# EasyEDA Pro project 平衡车.epro

# Schematic Schematic2_1
Create Date: 2023-04-02; Page Name: P1_1; Project Name: 平衡小车（大鱼电子）; Schematic Name: Schematic2_1; Update Date: 2024-01-26; Add into BOM: yes; Company: 深圳嘉立创科技发展有限公司; Convert to PCB: yes; Drawed: 嘉立创EDA; Page Size: A3; Part Number: JLCPCB-001; Reviewed: 嘉立创EDA; Version: V0.1
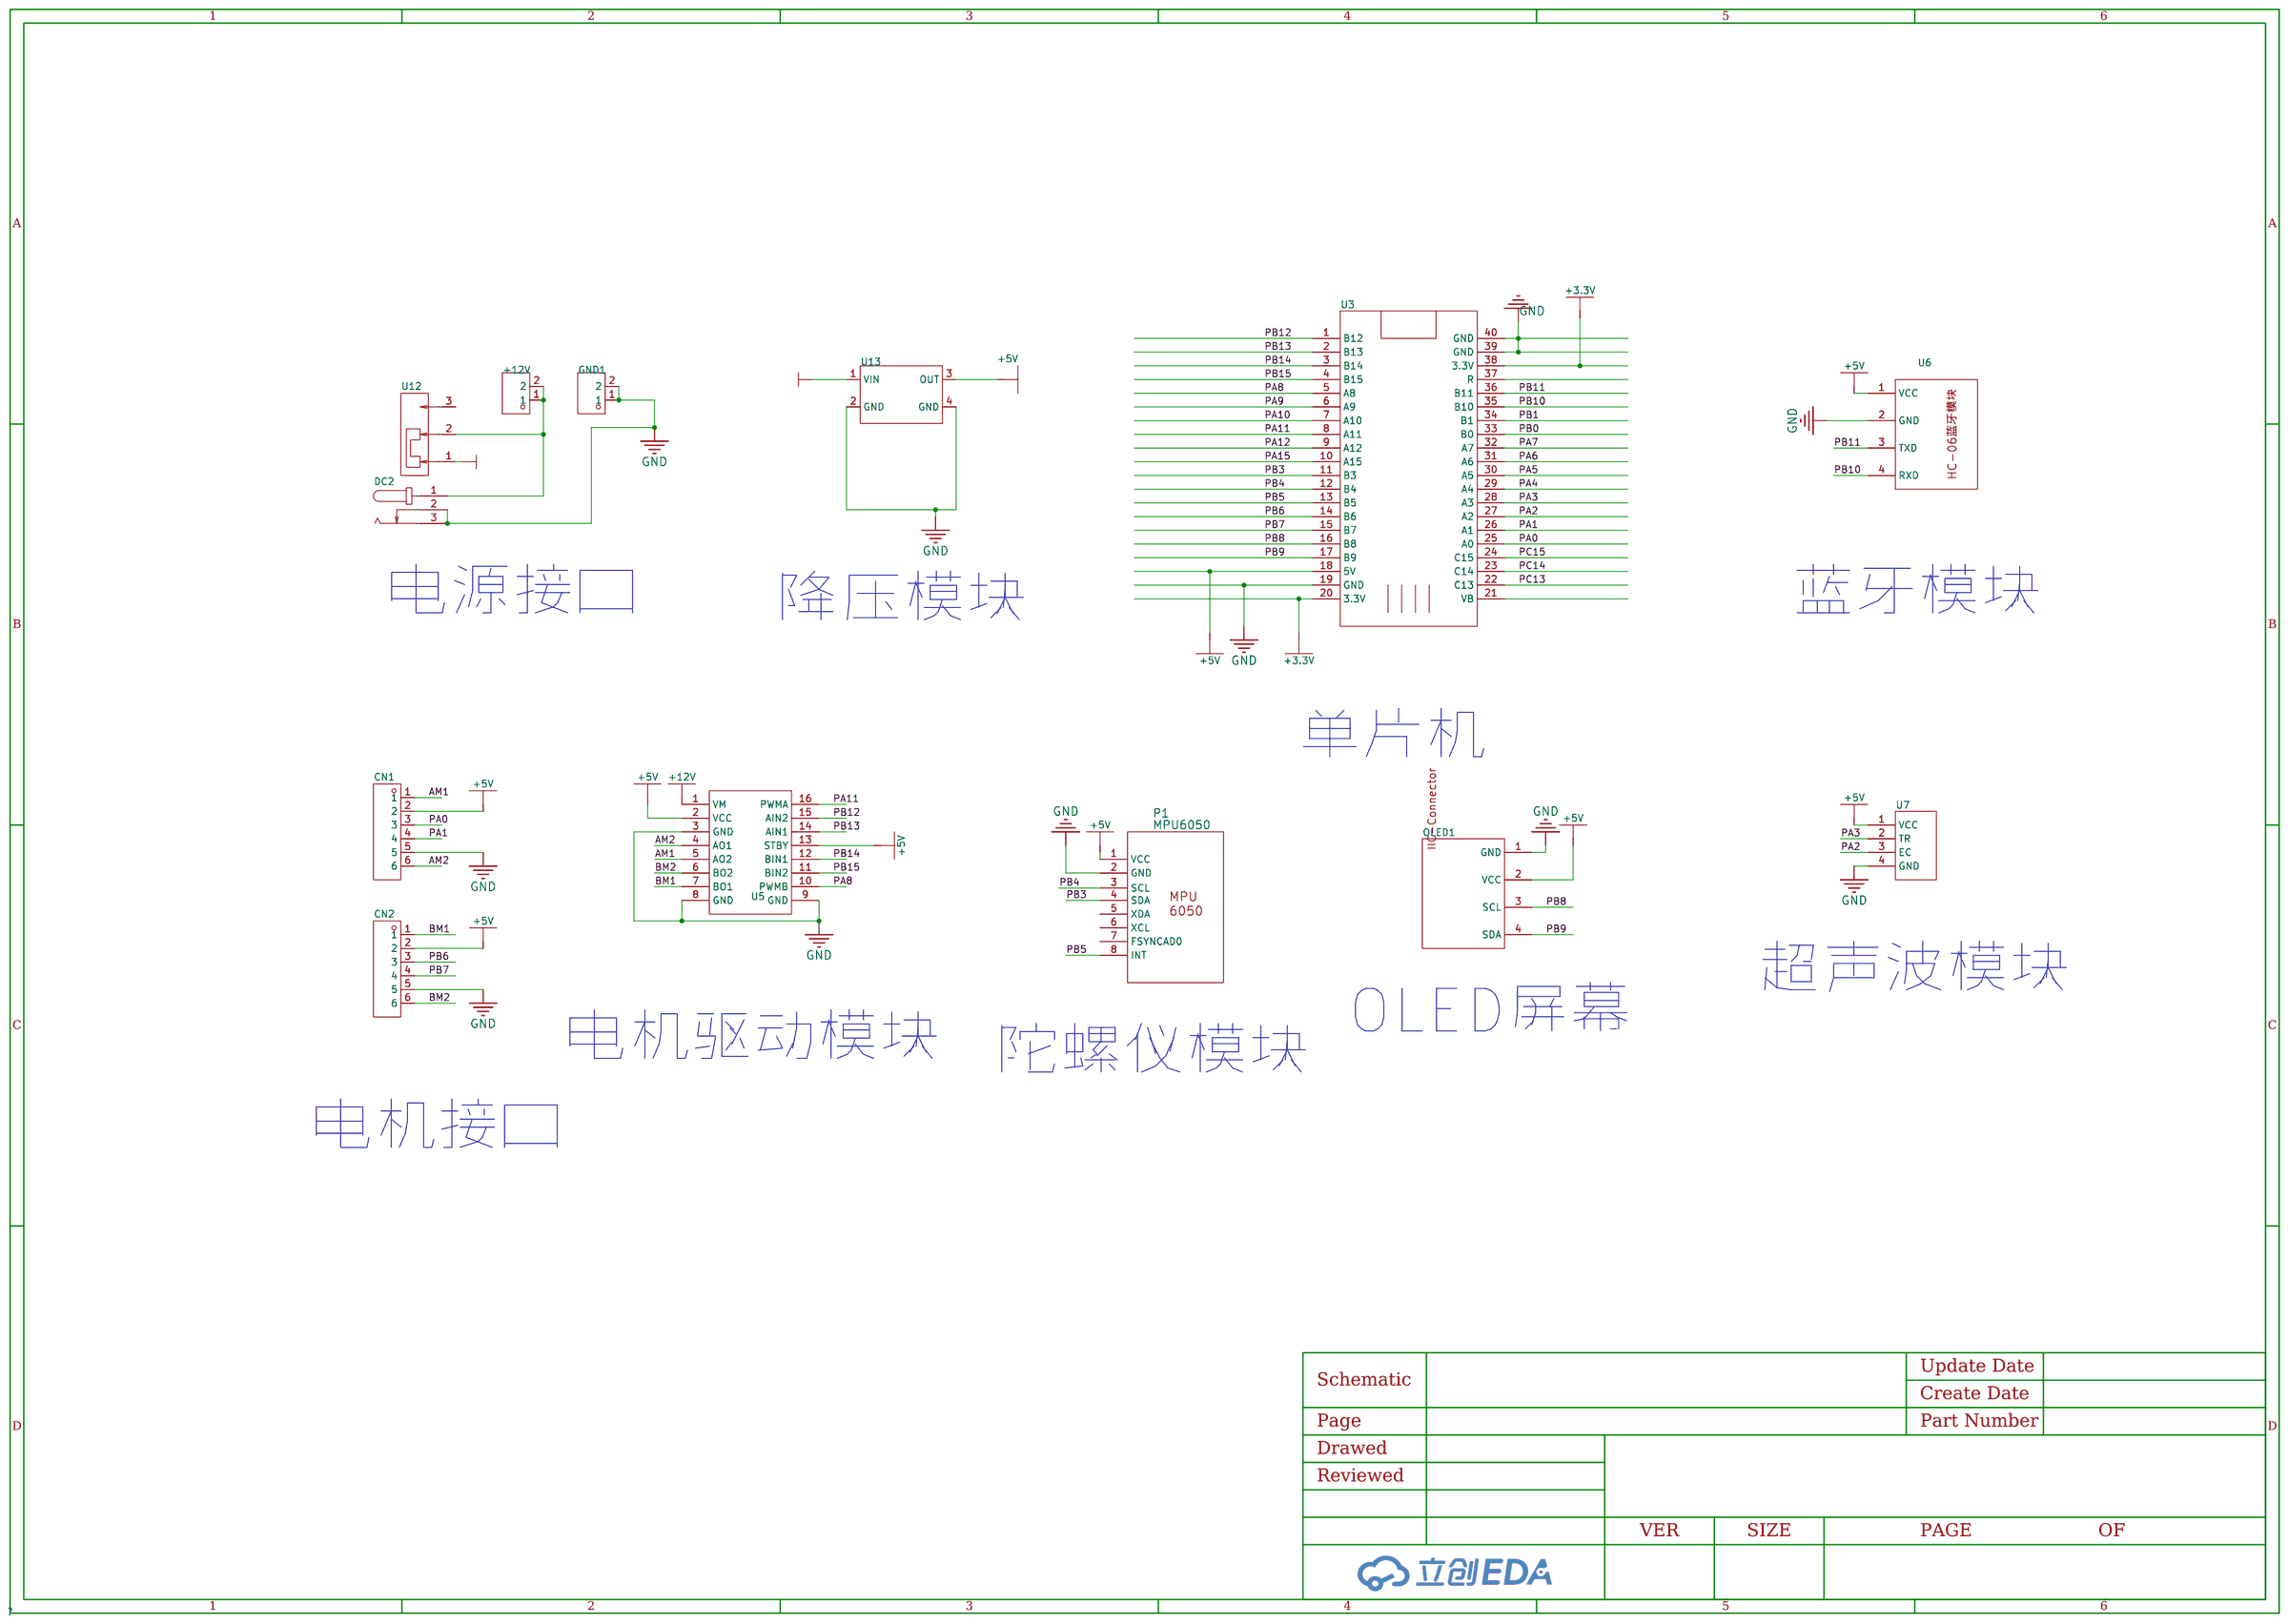
[diagram p0: schematic sheet]

## Parts
+12V  -  [HDR-TH_2P-P2.54-V]
CN1  PH2.0-6P  [PH2.0-6P 直针端子座]
CN2  PH2.0-6P  [PH2.0-6P 直针端子座]
DC2  -  [DC-IN-TH_KH-DC-005-2.5]
GND1  -  [HDR-TH_2P-P2.54-V]
OLED1  -  [0.96OLED_4P]
P1  MPU6050  [MPU6050]
U3  -  [STM32F103C8T6核心板]
U5  -  [TB6612FNG Module - 8pin x 2]
U6  蓝牙模块HC-06  [DIP-1X4P2.54（HC-06蓝牙模块）]
U7  -  [排母-4P]
U12  SS-12D10-G5  [SW-TH_SS-12D10-G050]
U13  -  [MP1584模块]

## Library data of the parts
+12V GND1 = 排针2P: 2.54 1*2P 直排针 0.8u镀金 PBT RoHS,针长3*6mm; Supplier Part: C152154; Manufacturer: Nextron(台湾正凌); Manufacturer Part: Z-211-0211-0021-001; LCSC On Sale: 1; Supplier Footprint: Through Hole,P=2.54mm; JLCPCB Part Class: Extended Part; JLCPCB Stock Number: 5280; Datasheet: https://atta.szlcsc.com/upload/public/pdf/source/20171225/C152154_15141883746031203216.pdf; Supplier: LCSC; Number of Positions: 2; Connector Type: 排针; Number of Rows: 1; Mounting Type: 通孔; Contact Type: 公形引脚; Pitch: 0.100; Contact Material: 黄铜
CN1 CN2 = PH2.0-6P: Pin Type: IN; Supplier: LCSC; Supplier Part: C722763; Manufacturer: CAX(创都); Manufacturer Part: PH2.0-4P; JLCPCB Part Class: Extended Part
DC2 = KH-DC-005-2.5: 连接器类型:DC电源插座;安装方式:弯插;触点内径:-;触点外径:6.4mm;额定电流:1A;额定电压:30V;工作温度范围:-25~+70;; LCSC Part Name: DC电源插座 外径:6.4mm; Supplier Part: C2847170; Manufacturer: kinghelm(金航标); Supplier Footprint: 插件; JLCPCB Part Class: Extended Part; Datasheet: https://atta.szlcsc.com/upload/public/pdf/source/20210716/C2847170_7F0110A0BEDEE81C68B76DF87AC8DA16.pdf; Supplier: LCSC; Connector Type: DC电源插座; Mounting Style: 弯插; Outside Contact Diameter: 6.4mm; Current Rating (Max): 1A; Voltage Rating (Max): 30V; Operating Temperature Range: -25~+70
OLED1 = 0.96OLED_4P: LCSC Part Name: 0.96OLED_4P_MODULE_JX; Supplier Part: C9900004566; Manufacturer Part: 0.96OLED_4P_MODULE_JX; Supplier Footprint: THrough hole; JLCPCB Part Class: Extended Part; Supplier: LCSC
P1 = MPU6050
U3 = stm32f103c8t6最小系统板
U5 = TB6612FNG模块: Pin Type: In
U6 = 蓝牙模块HC-06: Pin Type: IN
U7 = HC-SR04_1
U12 = SS-12D10-G5: 电路结构:单刀双掷;安装方式:直插;开关颜色:黑色;滑钮形状:矩形柱状;引脚样式:PC引脚;开关长度:12.7mm;开关宽度:6.7mm;开关高度:11.3mm;; LCSC Part Name: 插件大电流拨动开关; Supplier Part: C2998777; Manufacturer: DEALON(德艺隆); Supplier Footprint: 插件; JLCPCB Part Class: Extended Part; Datasheet: https://atta.szlcsc.com/upload/public/pdf/source/20220428/E10CB334ACBAF32CF4AF8D87DA871CD3.pdf; Supplier: LCSC; Circuit: 单刀双掷; Mounting Style: 直插; Actuator Color: 黑色; Actuator Style: 矩形柱状; Pin Style: PC引脚; Switch Length: 12.7mm; Switch Width: 6.7mm; Switch Height: 11.3mm
U13 = MP1584模块: Pin Type: IN

## Nets
+3.3V: U3.20(3.3V) U3.38(3.3V)
+5V: CN1.2 CN2.2 OLED1.2(VCC) P1.1(VCC) U3.18(5V) U5.2(VCC) U5.13(STBY) U6.1(VCC) U7.1(VCC) U13.3(OUT)
+12V: U5.1(VM) U12.1 U13.1(VIN)
GND: CN1.5 CN2.5 DC2.2 DC2.3 GND1.1 GND1.2 OLED1.1(GND) P1.2(GND) U3.19(GND) U3.39(GND) U3.40(GND) U5.3(GND) U5.8(GND) U5.9(GND) U6.2(GND) U7.4(GND) U13.2(GND) U13.4(GND)
AM1: CN1.1 U5.5(AO2)
AM2: CN1.6 U5.4(AO1)
BM1: CN2.1 U5.7(BO1)
BM2: CN2.6 U5.6(BO2)
PA0: CN1.3 U3.25(A0)
PA1: CN1.4 U3.26(A1)
PA2: U3.27(A2) U7.3(EC)
PA3: U3.28(A3) U7.2(TR)
PA4: U3.29(A4)
PA5: U3.30(A5)
PA6: U3.31(A6)
PA7: U3.32(A7)
PA8: U3.5(A8) U5.10(PWMB)
PA9: U3.6(A9)
PA10: U3.7(A10)
PA11: U3.8(A11) U5.16(PWMA)
PA12: U3.9(A12)
PA15: U3.10(A15)
PB0: U3.33(B0)
PB1: U3.34(B1)
PB3: P1.4(SDA) U3.11(B3)
PB4: P1.3(SCL) U3.12(B4)
PB5: P1.8(INT) U3.13(B5)
PB6: CN2.3 U3.14(B6)
PB7: CN2.4 U3.15(B7)
PB8: OLED1.3(SCL) U3.16(B8)
PB9: OLED1.4(SDA) U3.17(B9)
PB10: U3.35(B10) U6.4(RXD)
PB11: U3.36(B11) U6.3(TXD)
PB12: U3.1(B12) U5.15(AIN2)
PB13: U3.2(B13) U5.14(AIN1)
PB14: U3.3(B14) U5.12(BIN1)
PB15: U3.4(B15) U5.11(BIN2)
PC13: U3.22(C13)
PC14: U3.23(C14)
PC15: U3.24(C15)
$3N3363: +12V.1 +12V.2 DC2.1 U12.2

Not connected (* = marked no-connect by the designer): P1 5(XDA) 6(XCL) 7(FSYNCAD0); U3 21(VB) 37(R); U12 3

## Notes on the sheet
- 电源接口
- 降压模块
- 蓝牙模块
- 单片机
- 超声波模块
- OLED屏幕
- 电机驱动模块
- 陀螺仪模块
- 电机接口

# Board 标准版
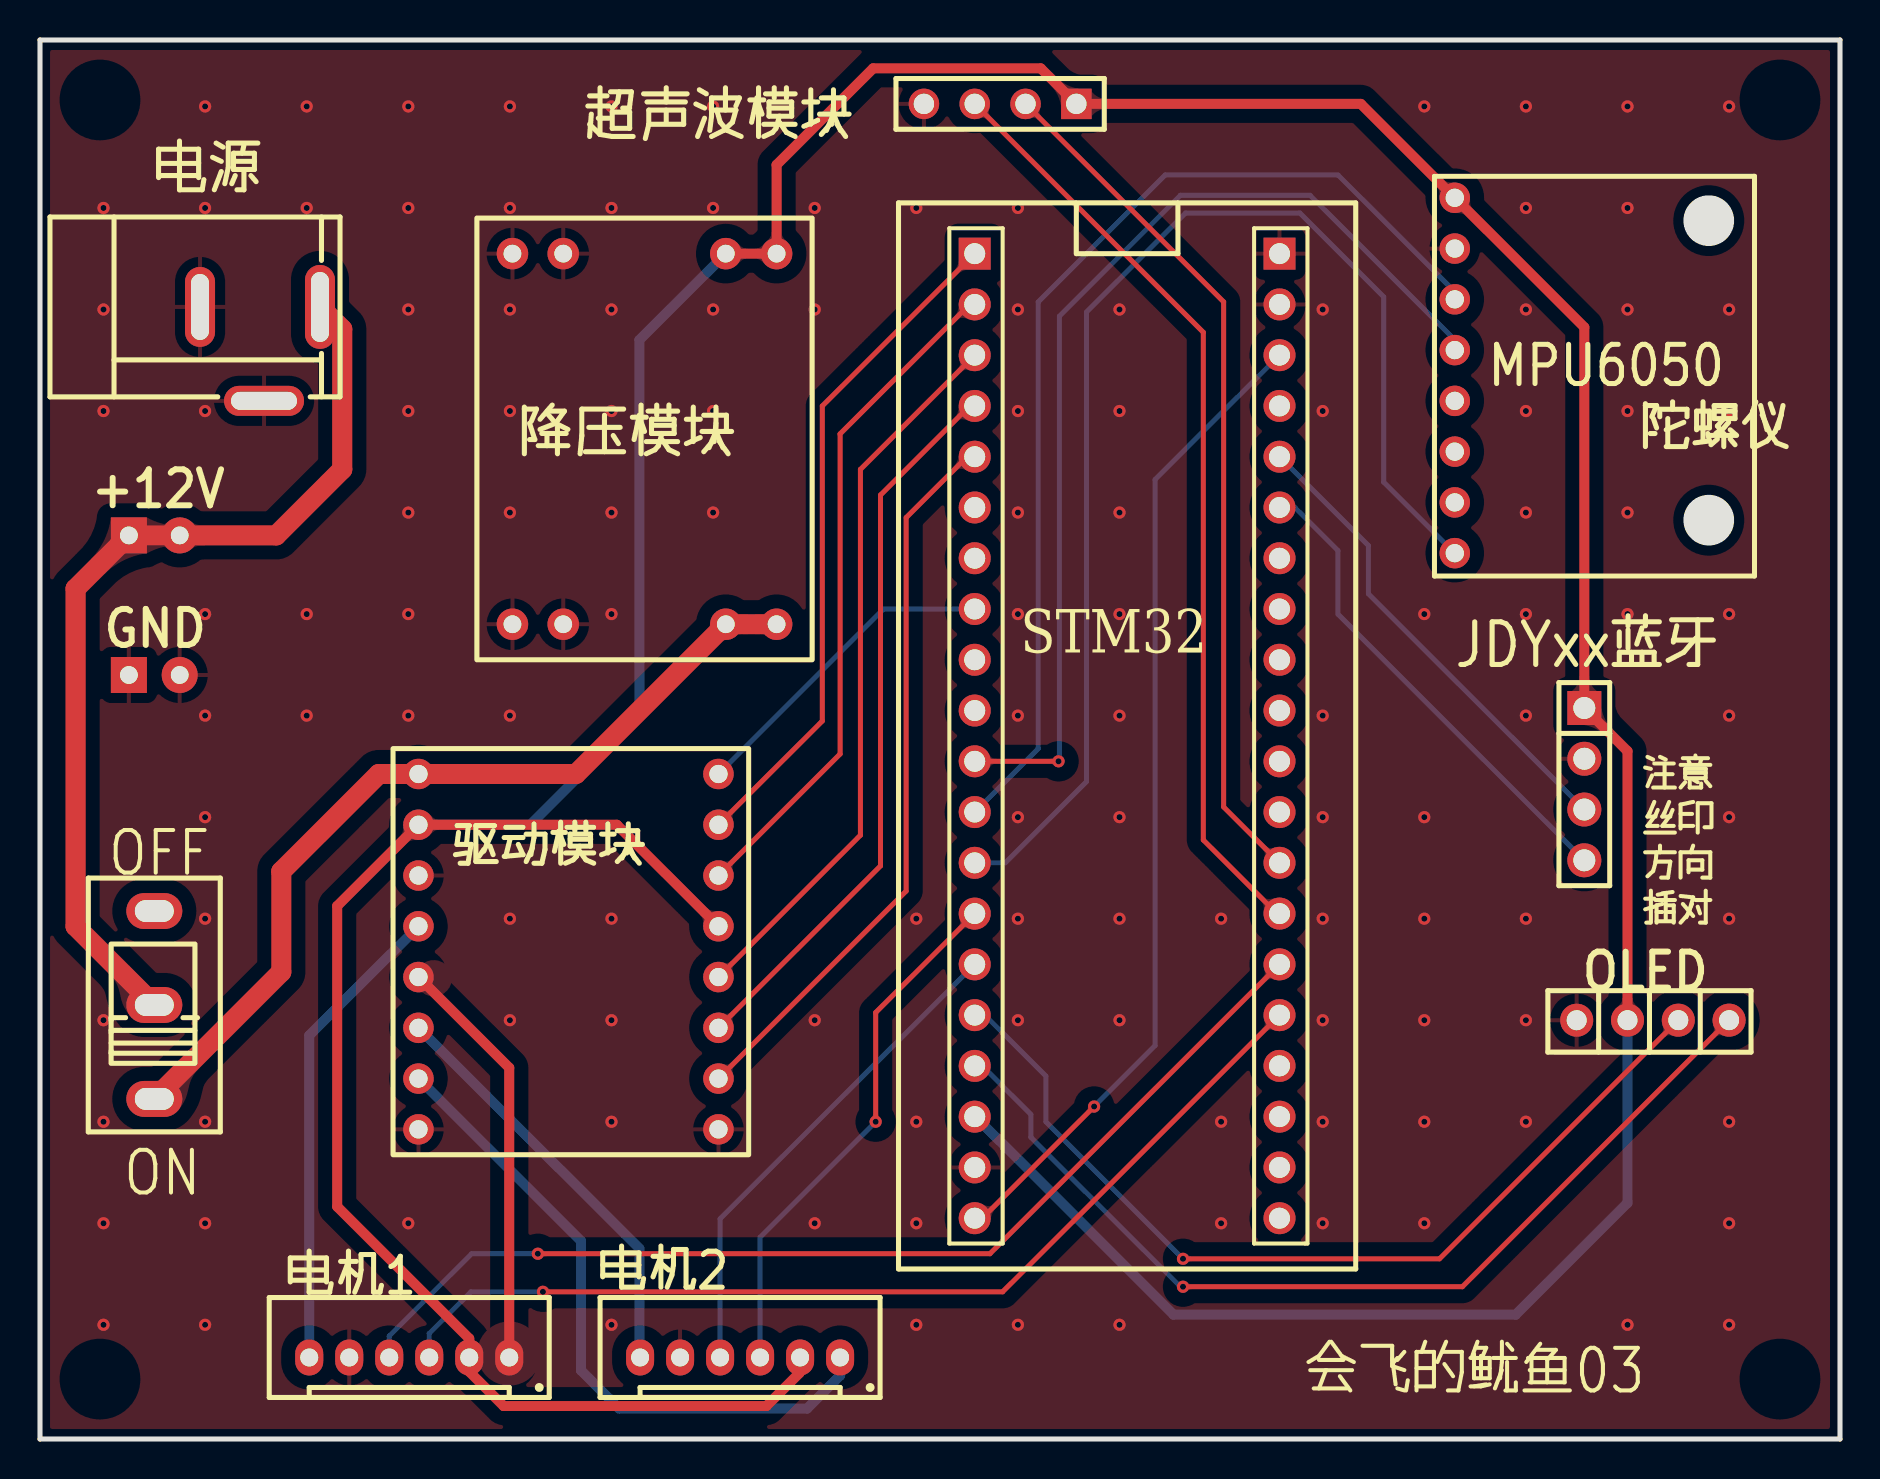
[diagram p1: board, top side]
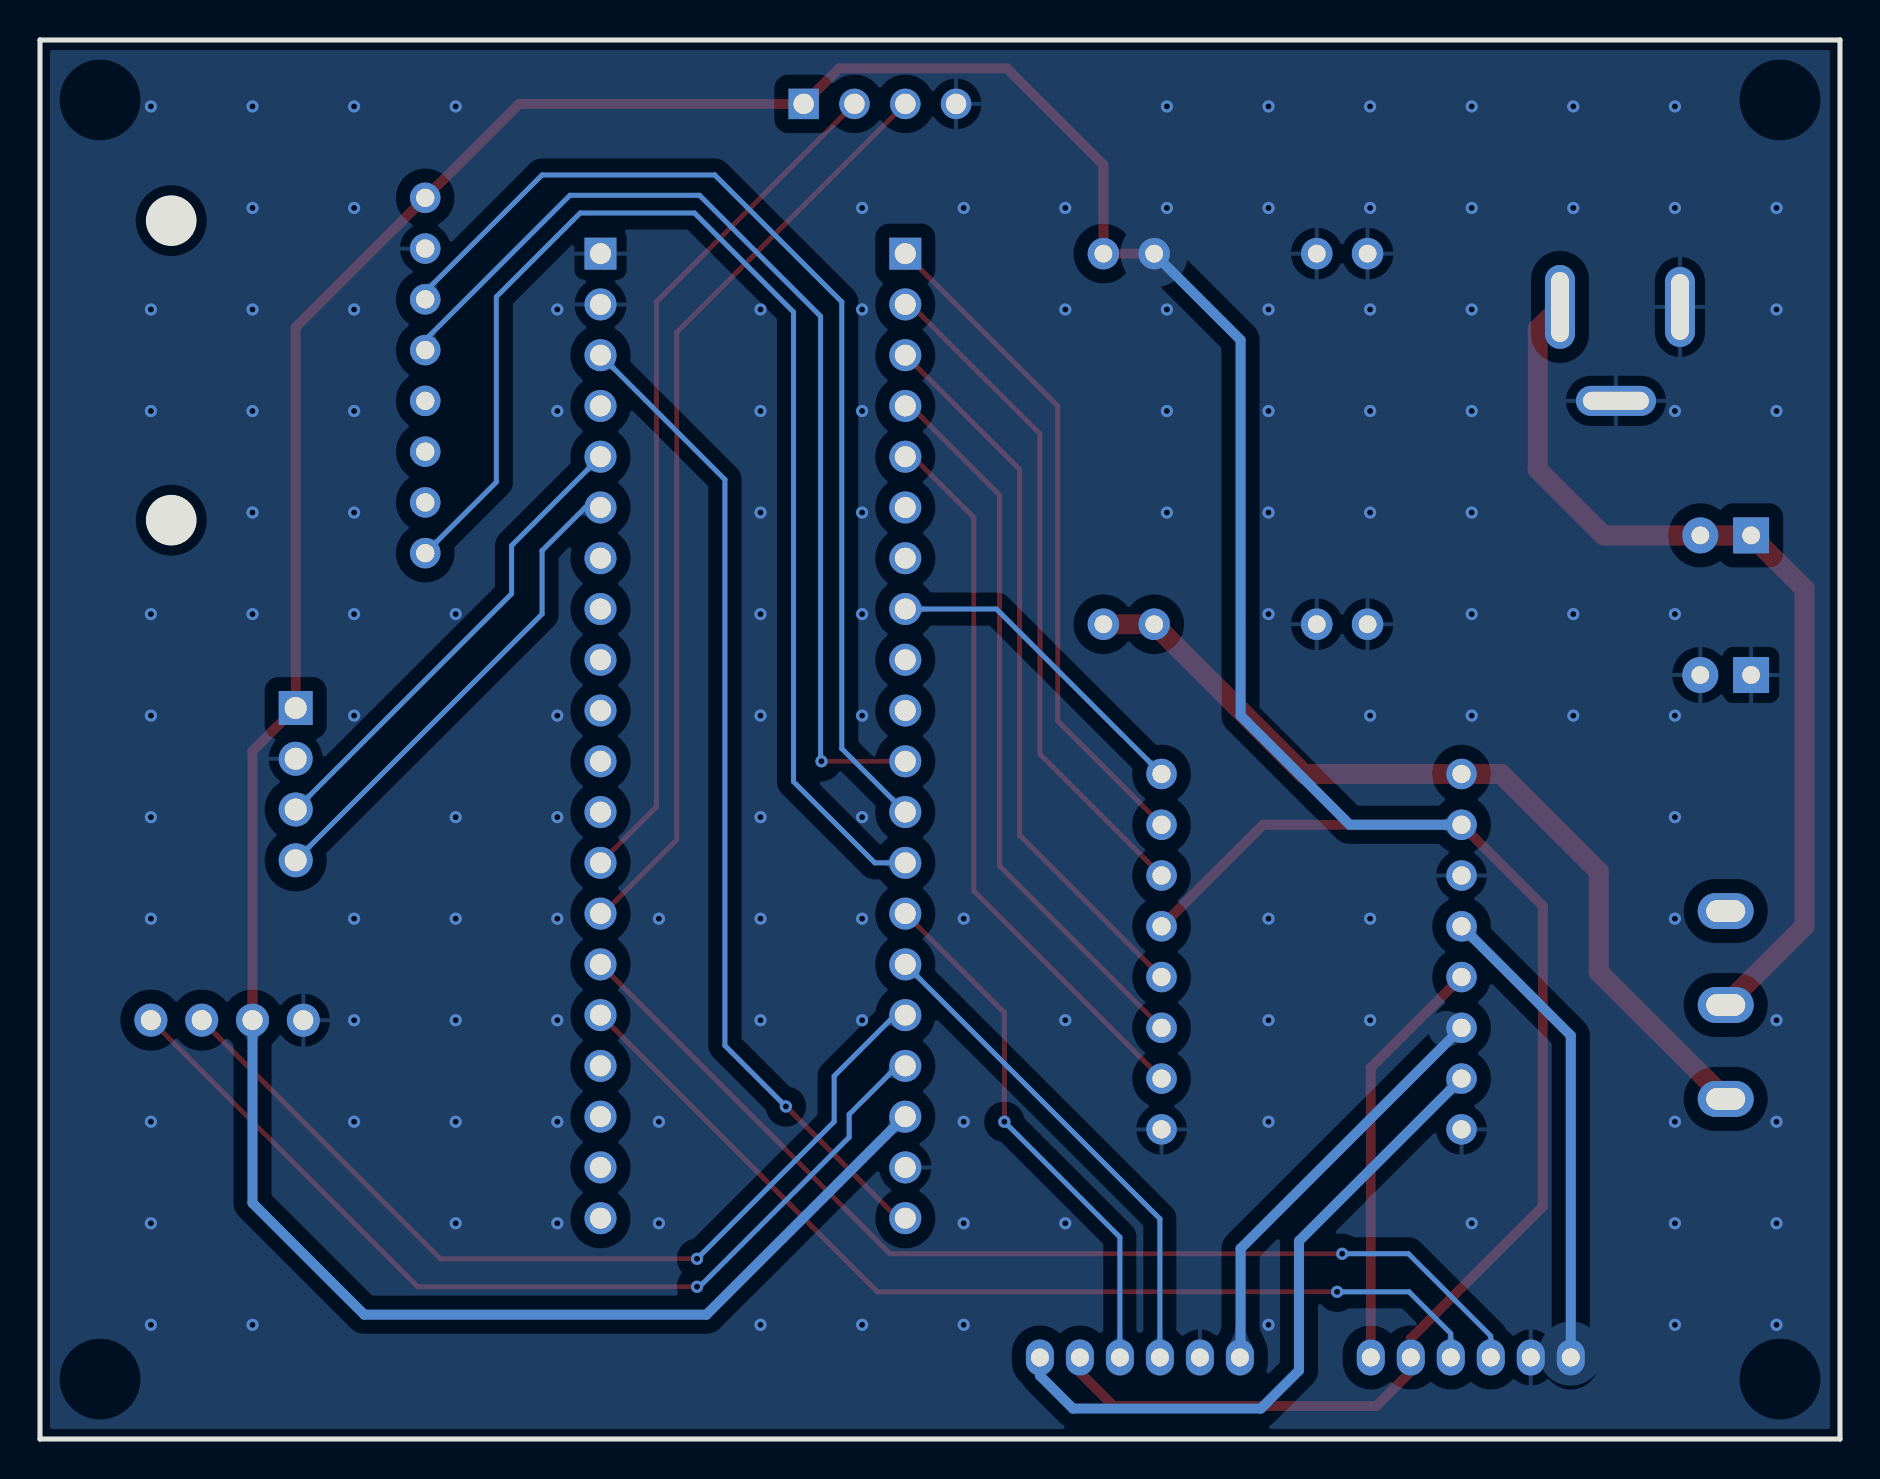
[diagram p2: board, bottom side, seen from below]

Outline 90 x 70 mm; copper layers: Top Layer, Bottom Layer. Coordinates in mm from the lower left corner of the outline.
Outline path: 0,70 90,70 90,0 0,0 0,70
Stack: Top Layer 0.035mm / Dielectric1 1.51mm FR4 er 4.5 / Bottom Layer 0.035mm

## Design rules (mm)
spacing safeClearance (default): track to track 0.152, other pairs 0.152 to 0.3
track width trackWidth (default): min 0.127, default 0.254, max 2.54
differential pair differentialPair (default): width min 0.127, default 0.254, max 2.54; gap min 0.152, default 0.152
via viaSize (default): diameter min 0.5, default 0.61, max 10; hole min 0.3, default 0.305, max 6
template: 用户自定义配置
spacing safeClearance (default): track to track 0.5, other pairs 0.5 to 0.5
track width trackWidth (default): min 0.127, default 0.254, max 2.54
differential pair differentialPair (default): width min 0.127, default 0.254, max 2.54; gap min 0.152, default 0.152
via viaSize (default): diameter min 0.5, default 0.61, max 10; hole min 0.3, default 0.305, max 6

## Placement (name value [footprint] x y rotation side)
+12V  -  [HDR-TH_2P-P2.54-V]  5.72 45.21 0 top
DC2  -  [DC-IN-TH_KH-DC-005-2.5]  11 54.29 0 top
GND  -  [HDR-TH_2P-P2.54-V]  5.72 38.23 0 top
OLED  -  [0.96OLED_4P]  80.64 20.95 0 top
P1  -  [MPU6050]  69.72 43.18 0 top
U3  -  [STM32F103C8T6核心板]  54.36 35.18 0 top
U6  蓝牙模块HC-06  [DIP-1X4P2.54（HC-06蓝牙模块）]  77.22 32.77 180 top
U7  -  [排母-4P]  51.82 66.8 180 top
U12  SS-12D10-G5  [SW-TH_SS-12D10-G050]  5.72 21.72 90 top
U13  -  [MP1584模块]  30.23 50.04 90 top
电机1  PH2.0-6P  [PH2.0-6P 直针端子座]  23.46 4.08 180 top
电机2  PH2.0-6P  [PH2.0-6P 直针端子座]  40.01 4.08 180 top
驱动模块  -  [TB6612FNG Module - 8pin x 2]  26.54 24.38 0 top

## Footprints (pads in the part's own frame, mm; a bottom-side part is the same pattern mirrored in y, then rotated)
0.96OLED_4P
  round 1.651 hole 1.001: 1(-3.81,0) 2(-1.27,0.003) 3(1.27,0.003) 4(3.81,0.003)
DC-IN-TH_KH-DC-005-2.5
  oval 1.501x4.201 hole 0.899x3.5: 1(2.999,2.349)
  oval 1.501x4 hole 0.899x3.3: 2(-2.999,2.349)
  oval 4x1.501 hole 3.3x0.899: 3(0.201,-2.349)
DIP-1X4P2.54（HC-06蓝牙模块）
  rect 1.7x1.7 hole 1.1: 1(0,-3.81)
  round 1.7 hole 1.1: 2(0,-1.27) 3(0,1.27) 4(0,3.81)
HDR-TH_2P-P2.54-V
  rect 1.801x1.801 hole 0.889: 1(-1.27,0)
  round 1.801 hole 0.889: 2(1.27,0)
MP1584模块
  round 1.575 hole 0.889: 1(-9.271,-4.064) 1(-9.271,-6.604) 2(-9.271,6.604) 2(-9.271,4.064) 3(9.271,-4.064) 3(9.271,-6.604) 4(9.271,6.604) 4(9.271,4.064)
MPU6050
  round 1.524 hole 0.914: 1(1.016,18.923) 2(1.016,16.383) 3(1.016,13.843) 4(1.016,11.303) 5(1.016,8.763) 6(1.016,6.223) 7(1.016,3.683) 8(1.016,1.143)
PH2.0-6P 直针端子座
  oval 1.4x1.8 hole 0.9: 1(0,0) 2(2,0) 3(4,0) 4(6,0) 5(8,0) 6(10,0)
STM32F103C8T6核心板
  rect 1.6x1.6 hole 1.049: 1(-7.62,24.13) 40(7.62,24.13)
  round 1.6 hole 1.049: 2(-7.62,21.59) 3(-7.62,19.05) 4(-7.62,16.51) 5(-7.62,13.97) 6(-7.62,11.43) 7(-7.62,8.89) 8(-7.62,6.35) 9(-7.62,3.81) 10(-7.62,1.27) 11(-7.62,-1.27) 12(-7.62,-3.81) 13(-7.62,-6.35) 14(-7.62,-8.89) 15(-7.62,-11.43) 16(-7.62,-13.97) 17(-7.62,-16.51) 18(-7.62,-19.05) 19(-7.62,-21.59) 20(-7.62,-24.13) 21(7.62,-24.13) 22(7.62,-21.59) 23(7.62,-19.05) 24(7.62,-16.51) 25(7.62,-13.97) 26(7.62,-11.43) 27(7.62,-8.89) 28(7.62,-6.35) 29(7.62,-3.81) 30(7.62,-1.27) 31(7.62,1.27) 32(7.62,3.81) 33(7.62,6.35) 34(7.62,8.89) 35(7.62,11.43) 36(7.62,13.97) 37(7.62,16.51) 38(7.62,19.05) 39(7.62,21.59)
SW-TH_SS-12D10-G050
  oval 1.8x2.8 hole 1.1x1.95: 1(-4.7,0) 2(0,0) 3(4.7,0)
TB6612FNG Module - 8pin x 2
  round 1.524 hole 0.914: 1(-7.62,8.89) 2(-7.62,6.35) 3(-7.62,3.81) 4(-7.62,1.27) 5(-7.62,-1.27) 6(-7.62,-3.81) 7(-7.62,-6.35) 8(-7.62,-8.89) 9(7.38,-8.89) 10(7.38,-6.35) 11(7.38,-3.81) 12(7.38,-1.27) 13(7.38,1.27) 14(7.38,3.81) 15(7.38,6.35) 16(7.38,8.89)
排母-4P
  rect 1.524x1.524 hole 1.02: 1(0,0)
  round 1.524 hole 1.02: 2(2.54,0) 3(5.08,0) 4(7.62,0)

## Nets
+3.3V: U3.20 U3.38
+5V: OLED.2 P1.1 U3.18 U6.1 U7.1 U13.3 电机1.2 电机2.2 驱动模块.2 驱动模块.13
+12V: U12.1 U13.1 驱动模块.1
GND: DC2.2 DC2.3 GND.1 GND.2 OLED.1 P1.2 U3.19 U3.39 U3.40 U6.2 U7.4 U13.2 U13.4 电机1.5 电机2.5 驱动模块.3 驱动模块.8 驱动模块.9
AM1: 电机1.1 驱动模块.5
AM2: 电机1.6 驱动模块.4
BM1: 电机2.1 驱动模块.7
BM2: 电机2.6 驱动模块.6
PA0: U3.25 电机1.3
PA1: U3.26 电机1.4
PA2: U3.27 U7.3
PA3: U3.28 U7.2
PA4: U3.29
PA5: U3.30
PA6: U3.31
PA7: U3.32
PA8: U3.5 驱动模块.10
PA9: U3.6
PA10: U3.7
PA11: U3.8 驱动模块.16
PA12: U3.9
PA15: U3.10
PB0: U3.33
PB1: U3.34
PB3: P1.4 U3.11
PB4: P1.3 U3.12
PB5: P1.8 U3.13
PB6: U3.14 电机2.3
PB7: U3.15 电机2.4
PB8: OLED.3 U3.16
PB9: OLED.4 U3.17
PB10: U3.35 U6.4
PB11: U3.36 U6.3
PB12: U3.1 驱动模块.15
PB13: U3.2 驱动模块.14
PB14: U3.3 驱动模块.12
PB15: U3.4 驱动模块.11
PC13: U3.22
PC14: U3.23
PC15: U3.24
$3N3363: +12V.1 +12V.2 DC2.1 U12.2
$3N13220: U3.21
$3N13221: U3.37

Pads without a net: P1 5 6 7; U12 3

## Via types
v1: diameter 0.61, hole 0.304, Top Layer to Bottom Layer, 125 vias
v2: diameter 0.61, hole 0.305, Top Layer to Bottom Layer, 7 vias

## Routing (per net, layer and track width the routed paths; a pad name or vN(x,y) marks a point on that pad's centre or on a via; arc(x,y) is an arc through that point)
+3.3V: length 49.7
  Top Layer w0.25: U3.20 47.12,11.05 v2(52.7,16.64)
  Bottom Layer w0.25: v2(52.7,16.64) 55.75,19.68 55.75,48.01 U3.38
+5V: length 244.3
  Top Layer w0.5: 电机2.2 37.97,4.05 37.97,3.3 36.32,1.65 23.18,1.65 21.46,3.37 电机1.2 21.46,5.03 14.86,11.63 14.86,26.67 驱动模块.2 28.84,30.73 驱动模块.13 ; OLED.2 79.38,34.42 U6.1 77.22,55.63 P1.1 66.04,66.8 U7.1 50.04,68.58 41.66,68.58 36.83,63.75 36.83,59.31 U13.3
  Bottom Layer w0.5: U3.18 46.77,16.13 56.67,6.22 73.79,6.22 79.38,11.81 OLED.2 ; U13.3 29.97,54.99 29.97,36.19 24.51,30.73 驱动模块.2
+12V: length 43.9
  Top Layer w1: 36.83,40.77 U13.1 26.8,33.27 驱动模块.1 16.94,33.27 12.06,28.4 12.06,23.37 U12.1
GND:
  vias: v1(3.18,61.59) v1(3.18,56.51) v1(3.18,51.43) v1(3.18,20.95) v1(3.18,15.87) v1(3.18,10.79) v1(3.18,5.72) v1(8.26,66.67) v1(8.26,61.59) v1(8.26,51.43) v1(8.26,41.27) v1(8.26,36.19) v1(8.26,31.11) v1(8.26,26.03) v1(8.26,15.87) v1(8.26,10.79) v1(8.26,5.72) v1(13.34,66.67) v1(13.34,61.59) v1(13.34,41.27) v1(13.34,36.19) v1(18.42,66.67) v1(18.42,61.59) v1(18.42,56.51) v1(18.42,51.43) v1(18.42,46.35) v1(18.42,41.27) v1(18.42,36.19) v1(18.42,10.79) v1(23.5,66.67) v1(23.5,61.59) v1(23.5,56.51) v1(23.5,51.43) v1(23.5,46.35) v1(23.5,36.19) v1(23.5,26.03) v1(23.5,20.95) v1(28.58,66.67) v1(28.58,61.59) v1(28.58,56.51) v1(28.58,51.43) v1(28.58,46.35) v1(28.58,41.27) v1(28.58,26.03) v1(28.58,20.95) v1(28.58,15.87) v1(28.58,5.72) v1(33.66,66.67) v1(33.66,61.59) v1(33.66,56.51) v1(33.66,51.43) v1(33.66,46.35) v1(38.73,61.59) v1(38.73,56.51) v1(38.73,20.95) v1(38.73,10.79) v1(43.82,61.59) v1(43.82,26.03) v1(43.82,15.87) v1(43.82,10.79) v1(43.82,5.72) v1(48.89,61.59) v1(48.89,56.51) v1(48.89,51.43) v1(48.89,46.35) v1(48.89,41.27) v1(48.89,36.19) v1(48.89,31.11) v1(48.89,26.03) v1(48.89,20.95) v1(48.89,5.72) v1(53.98,56.51) v1(53.98,51.43) v1(53.98,46.35) v1(53.98,41.27) v1(53.98,36.19) v1(53.98,31.11) v1(53.98,26.03) v1(53.98,20.95) v1(53.98,5.72) v1(59.05,26.03) v1(59.05,15.87) v1(59.05,10.79) v1(64.14,56.51) v1(64.14,51.43) v1(64.14,36.19) v1(64.14,31.11) v1(64.14,26.03) v1(64.14,20.95) v1(64.14,15.87) v1(64.14,10.79) v1(69.22,66.67) v1(69.22,41.27) v1(69.22,31.11) v1(69.22,26.03) v1(69.22,20.95) v1(69.22,15.87) v1(69.22,10.79) v1(74.3,66.67) v1(74.3,61.59) v1(74.3,56.51) v1(74.3,51.43) v1(74.3,46.35) v1(74.3,41.27) v1(74.3,36.19) v1(74.3,26.03) v1(74.3,20.95) v1(74.3,15.87) v1(79.38,66.67) v1(79.38,61.59) v1(79.38,56.51) v1(79.38,51.43) v1(79.38,46.35) v1(79.38,41.27) v1(79.38,5.72) v1(84.45,66.67) v1(84.45,56.51) v1(84.45,51.43) v1(84.45,41.27) v1(84.45,36.19) v1(84.45,31.11) v1(84.45,26.03) v1(84.45,15.87) v1(84.45,10.79) v1(84.45,5.72)
AM1: length 20.9
  Top Layer w0.5: 电机1.1 23.46,18.57 驱动模块.5
AM2: length 23.8
  Bottom Layer w0.5: 电机1.6 13.46,20.19 驱动模块.4
BM1: length 33.3
  Bottom Layer w0.5: 电机2.1 40.01,3.17 38.35,1.52 28.96,1.52 27.05,3.43 27.05,9.91 驱动模块.7
BM2: length 21.1
  Bottom Layer w0.5: 驱动模块.6 29.97,9.52 29.97,4.11 电机2.6
PA0: length 50.3
  Top Layer w0.25: U3.25 48.13,7.37 v2(25.15,7.37)
  Bottom Layer w0.25: v2(25.15,7.37) 21.55,7.37 19.46,5.28 电机1.3
PA1: length 53.3
  Top Layer w0.25: v2(24.89,9.27) 47.5,9.27 U3.26
  Bottom Layer w0.25: 电机1.4 17.46,5.16 21.58,9.27 v2(24.89,9.27)
PA2: length 46.9
  Top Layer w0.25: U3.27 61.85,26.29 58.17,29.97 58.17,55.37 U7.3
PA3: length 43.2
  Top Layer w0.25: U7.2 59.18,56.9 59.18,31.62 U3.28
PA8: length 36.6
  Top Layer w0.25: 驱动模块.10 43.31,27.42 43.31,46.1 46.36,49.15 U3.5
PA11: length 16.2
  Bottom Layer w0.25: U3.8 42.18,41.53 驱动模块.16
PB3: length 52.3
  Top Layer w0.25: v2(50.93,33.91) U3.11
  Bottom Layer w0.25: v2(50.93,33.91) 50.97,33.95 50.97,56.18 57.02,62.23 63.5,62.23 70.74,54.99 P1.4
PB4: length 53.1
  Bottom Layer w0.25: P1.3 70.74,57.4 64.9,63.25 56.26,63.25 49.91,56.9 49.91,34.54 U3.12
PB5: length 63.7
  Bottom Layer w0.25: U3.13 48.26,28.83 52.32,32.89 52.32,56.39 57.28,61.34 62.99,61.34 67.18,57.15 67.18,47.88 P1.8
PB6: length 26.7
  Top Layer w0.25: U3.14 41.78,21.34 v2(41.78,15.87)
  Bottom Layer w0.25: 电机2.3 36.01,10.1 v2(41.78,15.87)
PB7: length 24.9
  Bottom Layer w0.25: 电机2.4 34.01,11.02 U3.15
PB8: length 46.5
  Top Layer w0.25: v2(57.15,9.02) 69.97,9.02 OLED.3
  Bottom Layer w0.25: v2(57.15,9.02) 50.29,15.87 50.29,18.16 47.24,21.21 U3.16
PB9: length 48.5
  Top Layer w0.25: OLED.4 71.12,7.62 v2(57.15,7.62)
  Bottom Layer w0.25: U3.17 47.12,18.67 49.54,16.24 49.54,15.1 57.02,7.62 v2(57.15,7.62)
PB10: length 24.4
  Bottom Layer w0.25: U6.4 64.9,41.27 64.9,44.45 62.74,46.61 U3.35
PB11: length 24
  Bottom Layer w0.25: U3.36 66.42,44.7 66.42,42.29 U6.3
PB12: length 33.9
  Top Layer w0.25: U3.1 39.12,51.69 39.12,35.93 驱动模块.15
PB13: length 34
  Top Layer w0.25: 驱动模块.14 40.01,34.28 40.01,50.29 46.48,56.77 U3.2
PB14: length 36.4
  Top Layer w0.25: 驱动模块.12 41.02,30.21 41.02,48.51 U3.3
PB15: length 36.6
  Top Layer w0.25: U3.4 46.48,51.69 42.02,47.23 42.02,28.68 驱动模块.11
$3N3363: length 46.9
  Top Layer w1: U12.2 1.78,25.65 1.78,42.54 +12V.1 +12V.2 11.81,45.21 15.11,48.51 15.11,55.53 DC2.1

## Copper pours and planes (outline as drawn; the poured copper is in the pictures)
GND on Top Layer: -6.98,73.66 95,73.66 95,-4.45 -6.98,-4.45
GND on Bottom Layer: -5.33,72.52 91.57,72.52 91.57,-2.79 -5.33,-2.79

Small or netless copper shapes (teardrops, artwork), in the pictures only: 58 on Top Layer, 36 on Bottom Layer

## Text on the board
Top Silkscreen Layer: OFF | ON | 注意 / 丝印 / 方向 / 插对 | 会飞的鱿鱼03 | MPU6050 / 陀螺仪 | 电源 | 降压模块 | 超声波模块 | STM32 | JDYxx蓝牙
